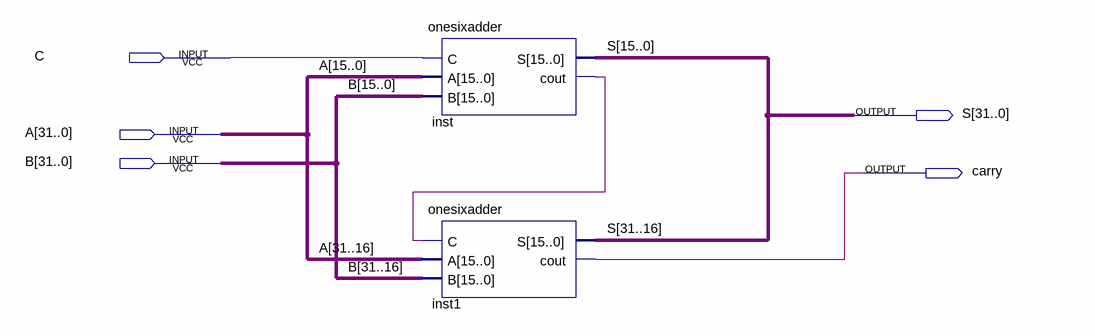
[diagram p0: schematic sheet]
// Quartus schematic threetwobitadder.bdf as structural Verilog: 2 symbols, 5 pins
module threetwobitadder (
  input  C,
  input  [31:0] A,
  input  [31:0] B,
  output [31:0] S,
  output carry
);

  wire inst_cout;

  onesixadder inst (.C(C), .A(A[15:0]), .B(B[15:0]), .S(S[15:0]), .cout(inst_cout));
  onesixadder inst1 (.C(inst_cout), .A(A[31:16]), .B(B[31:16]), .S(S[31:16]), .cout(carry));
endmodule
